# EasyEDA schematic SCH_HOME_2023-08-20.json
TITLE: Sheet_1; REV: 1.0; Date: 2023-07-17; Sheet: 1/1; Drawn By: vietquocvu5112002; Company: Your Company
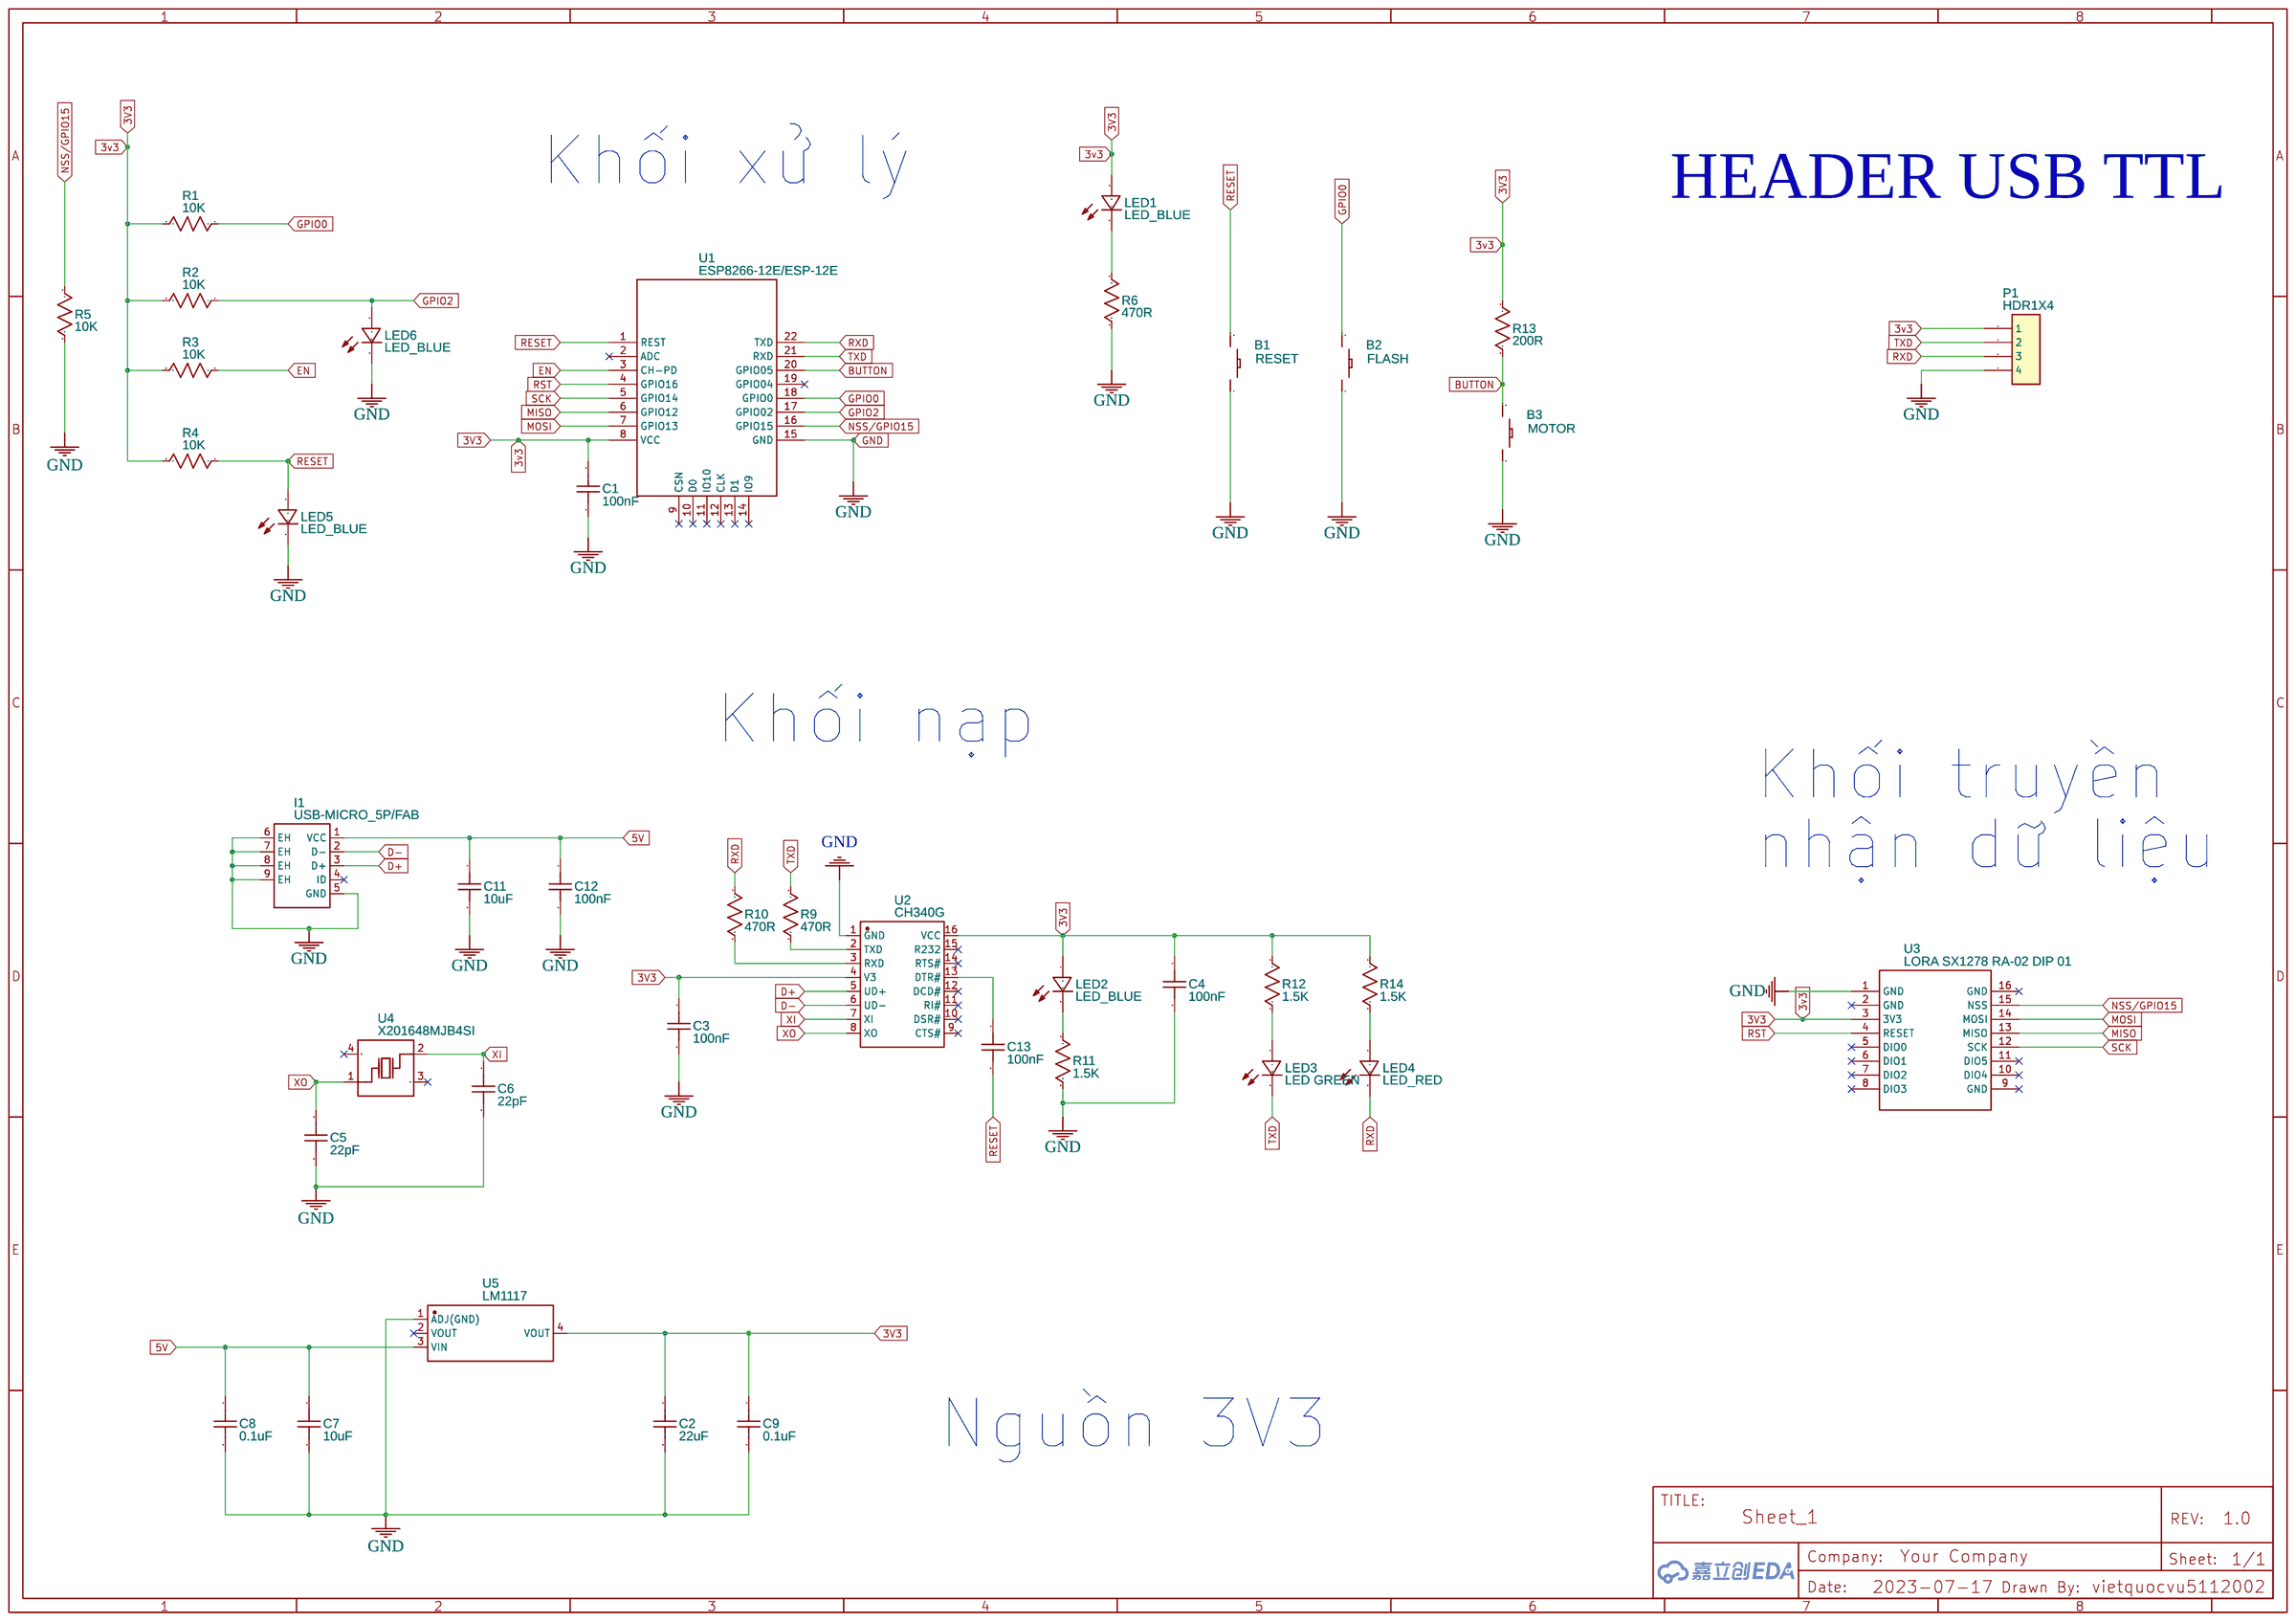
[diagram p0: schematic sheet]

## Parts
B1  RESET  [BUTTON_12X12X12]
B2  FLASH  [BUTTON_12X12X12]
B3  MOTOR  [BUTTON_12X12X12]
C1  100nF  [C0805]
C2  22uF  [C0805]
C3  100nF  [C0805]
C4  100nF  [C0805]
C5  22pF  [C0805]
C6  22pF  [C0805]
C7  10uF  [C0805]
C8  0.1uF  [C0805]
C9  0.1uF  [C0805]
C11  10uF  [C0805]
C12  100nF  [C0805]
C13  100nF  [C0805]
I1  USB-MICRO_5P/FAB  [MICRO-USB-SMD_USB-MICRO_5P-FAB]
LED1  LED_BLUE  [LED0805-R-RD]
LED2  LED_BLUE  [LED0805-R-RD]
LED3  LED GREEN  [LED0805-R-RD]
LED4  LED_RED  [LED0805-R-RD]
LED5  LED_BLUE  [LED0805-R-RD]
LED6  LED_BLUE  [LED0805-R-RD]
P1  HDR1X4  [HDR-F-2.54_1X4 (USB TTL)]
R1  10K  [R0805]
R2  10K  [R0805]
R3  10K  [R0805]
R4  10K  [R0805]
R5  10K  [R0805]
R6  470R  [R0805]
R9  470R  [R0805]
R10  470R  [R0805]
R11  1.5K  [R0805]
R12  1.5K  [R0805]
R13  200R  [R0805]
R14  1.5K  [R0805]
U1  ESP8266-12E/ESP-12E  [ESP8266-12E]
U2  CH340G  [SOIC-16_L9.9-W3.9-P1.27-LS6.0-BL]
U3  LORA SX1278 RA-02 DIP 01  [LORA SX1278 RA-02 DIP 01]
U4  X201648MJB4SI  [CRYSTAL-TH_L11.1-W4.7]
U5  LM1117  [SOT-223-3_L6.5-W3.4-P2.30-LS7.0-BR]

## Library data of the parts
B1-B3 = button: Contributor: laura.puyet1
C1-C9 C11-C13 = C_0603_US: Contributor: LCEDA_Lib
I1 = USB-MICRO_5P/FAB: Supplier: LCSC; Supplier Part: C9900004593; Manufacturer: null; Contributor: LCSC; JLCPCB Part Class: Extended Part
LED1-LED6 = LED_BLUE: Supplier: LCSC; Supplier Part: C9900016117; Manufacturer: null; JLCPCB Part Class: Extended Part; Contributor: lcsc
P1 = HDR1X4: sourceId: dV3XRL2kC
R1-R6 R9-R14 = R_0603_US: Contributor: LCEDA_Lib
U1 = ESP8266-12E/ESP-12E: SMD ESP8266 based WiFi module FCC/CE
U2 = CH340G: Supplier: LCSC; Manufacturer: WCH(南京沁恒); Supplier Part: C14267; JLCPCB Part Class: Extended Part
U3 = LORA SX1278 RA-02 DIP 01: Contributor: rhalfcaacbay
U4 = X201648MJB4SI: Supplier: LCSC; Supplier Part: C9900016209; Manufacturer: null; JLCPCB Part Class: Extended Part; Contributor: lcsc
U5 = AMS1117-ADJ_C2891840: Supplier: LCSC; Supplier Part: C2891840; Manufacturer: YONGYUTAI(永裕泰); Manufacturer Part: AMS1117-ADJ; Contributor: LCSC; JLCPCB Part Class: Extended Part

## Nets
3V3: C1.2 C2.1 C3.1 C4.1 C9.1 LED1.1 LED2.1 P1.1 R1.2 R2.2 R3.2 R4.2 R12.1 R13.1 R14.1 U1.8(VCC) U2.4(V3) U2.16(VCC) U3.3(3V3) U5.4(VOUT)
5V: C7.1 C8.1 C11.1 C12.1 I1.1(VCC) U5.3(VIN)
GND: B1.1 B2.1 B3.1 C1.1 C2.2 C3.2 C4.2 C5.2 C6.2 C7.2 C8.2 C9.2 C11.2 C12.2 I1.5(GND) I1.6(EH) I1.7(EH) I1.8(EH) I1.9(EH) LED5.2 LED6.2 P1.4 R5.2 R6.2 R11.2 U1.15(GND) U2.1(GND) U3.1(GND) U5.1(ADJ(GND))
BUTTON: B3.3(2) R13.2 U1.20(GPIO05)
D+: I1.3(D+) U2.5(UD+)
D-: I1.2(D-) U2.6(UD-)
EN: R3.1 U1.3(CH-PD)
GPIO0: B2.3(2) R1.1 U1.18(GPIO0)
GPIO2: LED6.1 R2.1 U1.17(GPIO02)
MISO: U1.6(GPIO12) U3.13(MISO)
MOSI: U1.7(GPIO13) U3.14(MOSI)
NSS/GPIO15: R5.1 U1.16(GPIO15) U3.15(NSS)
RESET: B1.3(2) C13.2 LED5.1 R4.1 U1.1(REST)
RST: U1.4(GPIO16) U3.4(RESET)
RXD: LED4.2 P1.3 R10.1 U1.22(TXD)
SCK: U1.5(GPIO14) U3.12(SCK)
TXD: LED3.2 P1.2 R9.1 U1.21(RXD)
XI: C6.1 U2.7(XI) U4.2(OSC2)
XO: C5.1 U2.8(XO) U4.1(OSC1)
Net-(C13-1): C13.1 U2.13(DTR#)
Net-(LED1-2): LED1.2 R6.1
Net-(LED2-2): LED2.2 R11.1
Net-(LED3-1): LED3.1 R12.2
Net-(LED4-1): LED4.1 R14.2
Net-(R9-2): R9.2 U2.2(TXD)
Net-(R10-2): R10.2 U2.3(RXD)

Not connected (* = marked no-connect by the designer): I1 4(ID)*; U1 2(ADC)* 9(CSN)* 10(D0)* 11(IO10)* 12(CLK)* 13(D1)* 14(IO9)* 19(GPIO04)*; U2 9(CTS#)* 10(DSR#)* 11(RI#)* 12(DCD#)* 14(RTS#)* 15(R232)*; U3 2(GND)* 5(DIO0)* 6(DIO1)* 7(DIO2)* 8(DIO3)* 9(GND)* 10(DIO4)* 11(DIO5)* 16(GND)*; U4 3(GND)* 4(GND)*; U5 2(VOUT)*

## Notes on the sheet
- Khối xử lý
- HEADER USB TTL
- Khối nạp
- Khối truyền
- nhận dữ liệu
- Nguồn 3V3
